# Altium schematic sheet Lipol_battery_charger.SchDoc
size A; SheetNumber: 1; SheetTotal: 1
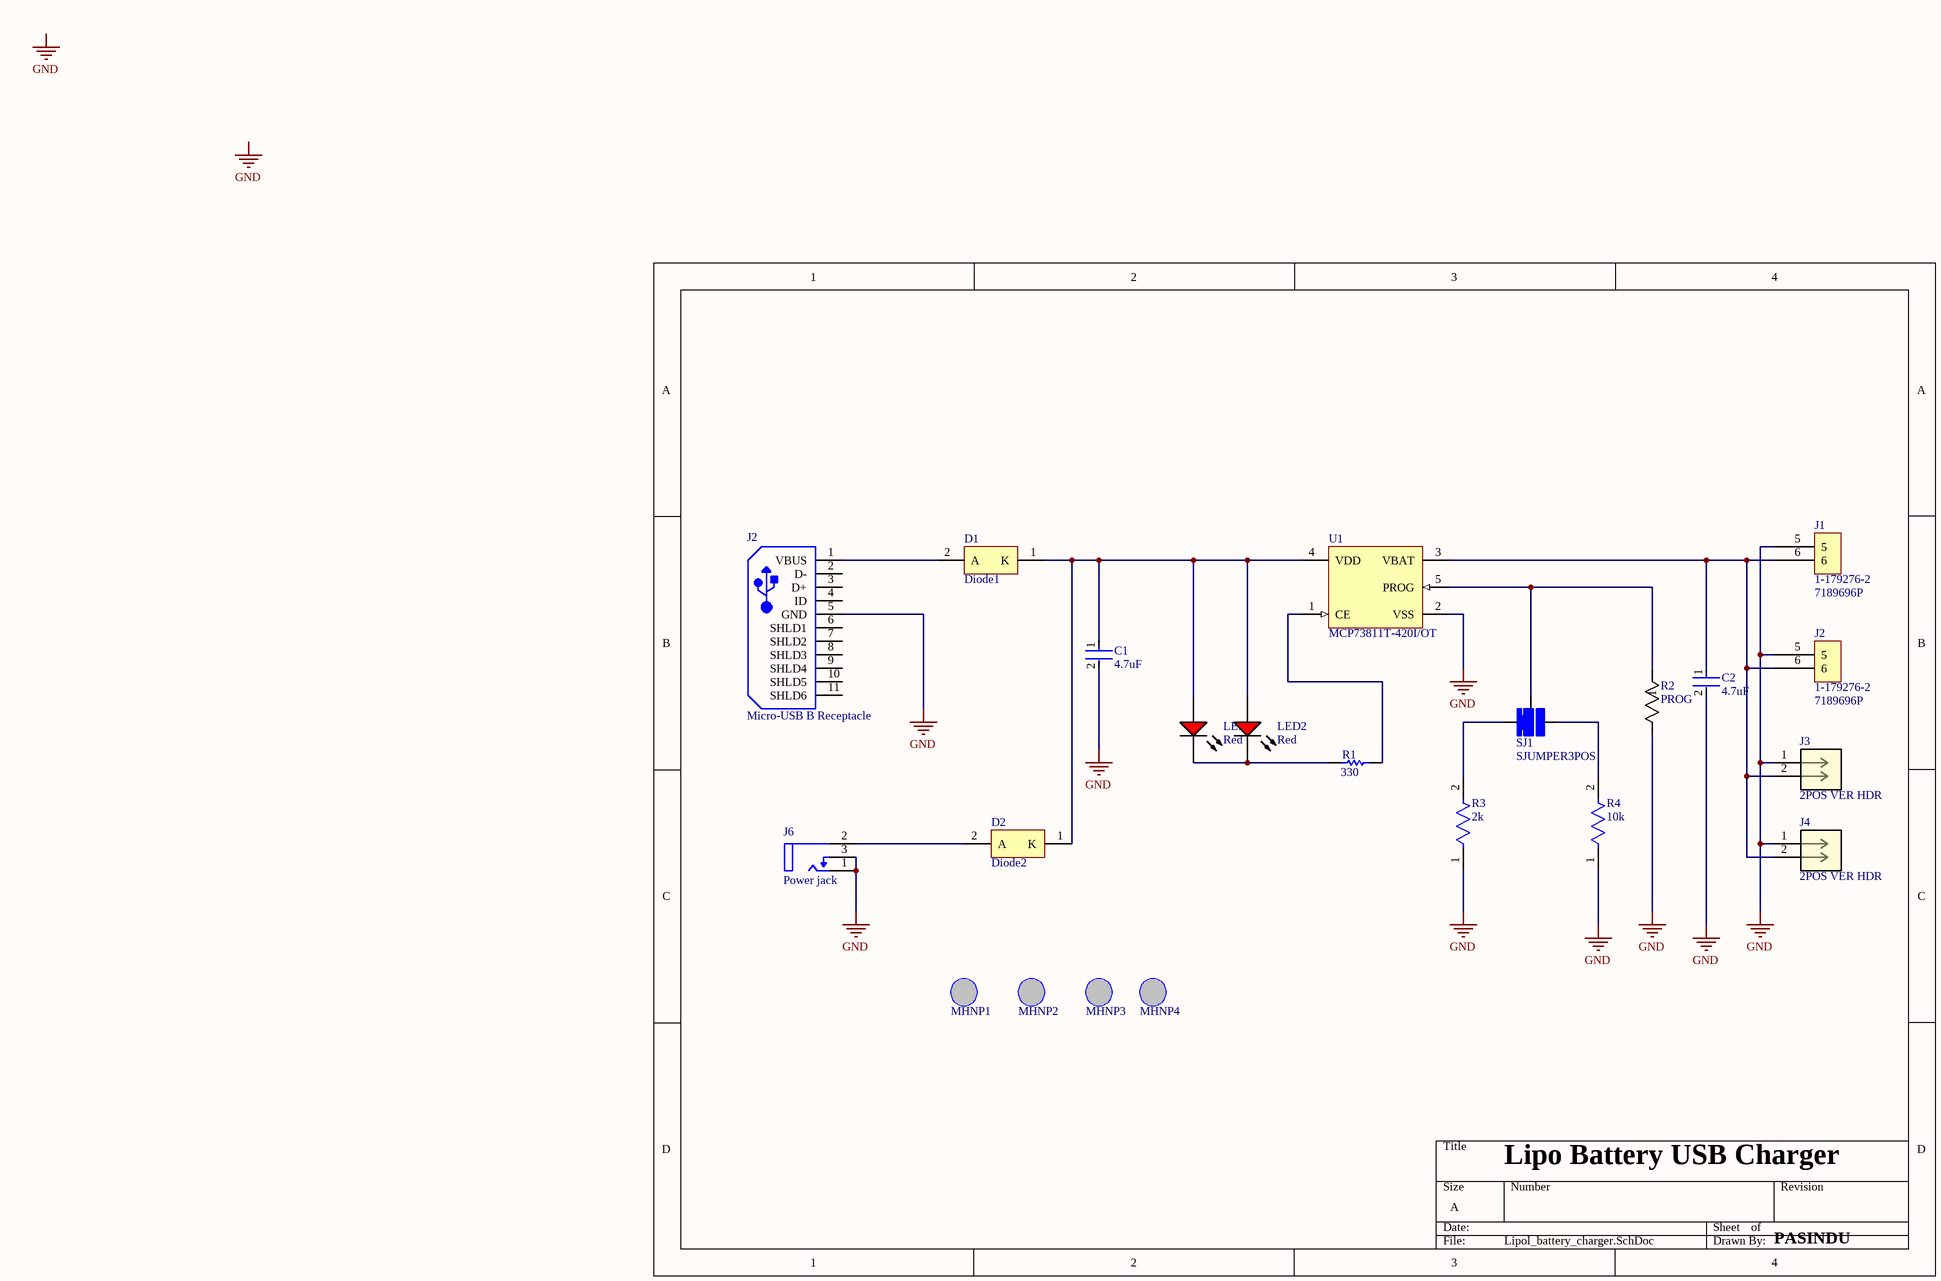
[diagram p0: Lipol_battery_charger.SchDoc]

## Parts
(Parts that share a designator on the sheet are numbered #1, #2 ... from top to bottom, then left to right.)
C1  4.7uF  [FP-CL10-IPC_C]
C2  4.7uF  [FP-CL10-IPC_C]
D1  Diode1  [ONSC-SMA-2-403D-02_V]
D2  Diode2  [ONSC-SMA-2-403D-02_V]
J1  1-179276-2  Supplier Part Number 1: 7189696P  [1-179276-2]
J2#1  Micro-USB B Receptacle  [USB-MICRO-B_V]
J2#2  1-179276-2  Supplier Part Number 1: 7189696P  [1-179276-2]
J3  2POS VER HDR  [CONN2_M20-999_1x2_HRW]
J4  2POS VER HDR  [CONN2_M20-999_1x2_HRW]
J6  Power jack  [FP-RASM722PTR13X-MFG]
LED1  Red  [VISH-TLMX1100_V]
LED2  Red  [VISH-TLMX1100_V]
MHNP1  Mounting hole non plated 3.2mm  [MHNP3P2MM]  (value not drawn)
MHNP2  Mounting hole non plated 3.2mm  [MHNP3P2MM]  (value not drawn)
MHNP3  Mounting hole non plated 3.2mm  [MHNP3P2MM]  (value not drawn)
MHNP4  Mounting hole non plated 3.2mm  [MHNP3P2MM]  (value not drawn)
R1  330  [RESC2013X70X40ML20T20]
R2  PROG  [RES_AC03_VIS]
R3  2k  [FP-CRCW0805-HPe3-IPC_C]
R4  10k  [FP-CRGCQ0805-IPC_C]
SJ1  SJUMPER3POS  [SJUMPER3POS-Footprint-1]
U1  MCP73811T-420I/OT  [SOT-23-OT5_L]

## Nets
GND: C1.2 C2.2 J1.5 J2#1.5(GND) J2#2.5 J3.1 J4.1 J6.1(TIP_TERMINAL(CENTER_PIN)) J6.3(SHUNT_TERMINAL) R2.2 R3.1 R4.1 U1.2(VSS)
NetC1_1: C1.1 D1.1(K) D2.1(K) LED1.1(A) LED2.1(A) U1.4(VDD)
NetC2_1: C2.1 J1.6 J2#2.6 J3.2 J4.2 U1.3(VBAT)
NetD1_2: D1.2(A) J2#1.1(VBUS)
NetD2_2: D2.2(A) J6.2(SLEEVE_TERMINAL)
NetLED1_2: LED1.2(K) LED2.2(K) R1.1
NetR1_2: R1.2 U1.1(CE)
NetR2_1: R2.1 SJ1.2 U1.5(PROG)
NetR3_2: R3.2 SJ1.1
NetR4_2: R4.2 SJ1.3

Not connected (* = marked no-connect by the designer): J2#1 2(D-) 3(D+) 4(ID) 6(SHLD1) 7(SHLD2) 8(SHLD3) 9(SHLD4) 10(SHLD5) 11(SHLD6)

## Notes on the sheet
- Lipo Battery USB Charger
- PASINDU
- Labels drawn without touching a wire or pin: GND

## Library data of the parts
C1 C2 = CMP-2000-06096-2: CAP CER 4.7UF 6.3V X7R 0603; Manufacturer: Samsung; Manufacturer Part Number: CL10B475KQ8NQNC; Tolerance: 10%; Material: Ceramic; Temperature Coefficient: 15%; Device Class L3: Ceramic Capacitors; Temperature Characteristic: X7R; Automotive: No; Capacitance: 4.7uF; Package: CL10; Device Class L2: Capacitors; Octopart: https://octopart.com/cl10b475kq8nqnc-samsung-24957976; ComponentLink2Description: Datasheet; Temperature Range High: +125°C; Lead Free: Yes; Height: 0.95mm; Temperature: -55°C to +125°C; Ipc Land Pattern Name: CAPC16080X80; Temperature Range Low: -55°C; Digikey Description: CAP CER 4.7UF 6.3V X7R 0603; Mouser Description: C Series 0402 4.7 uF 6.3 V ±20 % Tolerance X5R SMT Multilayer Ceramic Capacitor; Category: Cap; ComponentLink2URL: http://www.samsungsem.com/kr/support/product-search/mlcc/__icsFiles/afieldfile/2018/07/24/CL10B475KQ8NQNC.pdf; Value: 4.7uF; Voltage Rating: 6.3V; Device Class L1: Passive Components; RoHS: TRUE
D1 D2 = CMP-1055-00320-1: Schottky Power Rectifier, 2-Pin SMA, Pb-Free, Tape and Reel; PartNumber: MBRA140T3G; Manufacturer: On Semiconductor; Configuration: Single; IFSM Max (A): 30; PackageReference: SMA-2-403D-02; PackageDescription: 2-Pin Small Molded Package, J-Bend Lead, Body 2.605 x 4.315 mm; RoHS: TRUE; ComponentLink1Description: Manufacturer URL; Packing: Tape and Reel; ComponentLink3URL: http://www.onsemi.com/pub_link/Collateral/403D-02.PDF; ComponentLink2Description: Datasheet; ComponentLink2URL: http://www.onsemi.cn/pub_link/Collateral/MBRA140T3-D.PDF; DatasheetVersion: Rev. 10; ComponentLink1URL: http://www.onsemi.com/; ComponentLink3Description: Package Specification; Mounting Technology: Surface Mount; PackageVersion: Rev. G, 07/2012
J1 J2#2 = 1-179276-2: DYNAMIC 3200 HDR ASSY 2P H; Manufacture: TE connectivity; Supplier 1: Rs; Manufacture part Number: 1-179276-2; ComponentLink1Description: product URL; ComponentLink1URL: https://octopart.com/search?q=1-179276-2&filter%5Bfields%5D%5Bbrand.name%5D%5B%5D=TE+Connectivity
J2#1 = CMP-2000-05827-1: Micro-USB B Receptacle, Right Angle, Bottom Mount, Surface Mount, with Solder Tabs, -30 to 85 degC, 5-Pin USB, RoHS, Tape and Reel; Manufacturer: Molex; Featured Product: Micro-USBConnectorsUSBConnectors; Other Names: WM1399DKR; Package Version: Rev. F, 12/2012; Number of Contacts: 5; Connector Type: USB-microB; Catalog Drawings: 1050170001; 3D Model: 105017-0001.stp; Mating Products: WM17145-ND-CABLEMICROUSBBTOSTDA1.0MWM17147-ND-CABLEMICROUSBBTOSTDA2.0MWM17146-ND-CABLEMICROUSBBTOSTDA1.5M; PCN Assembly/Origin: ResinSupplier21/Oct/2015; Voltage - Max: 30V; Online Catalog: Molex-MicroUSB; Manufacturer URL: http://www.molex.com/; Package Description: 5-Leads USB, Micro B, Body 7.5 x 5 mm, Pitch 0.65 mm; Datasheet URL: http://www.molex.com/elqNow/elqRedir.htm?ref=http://www.molex.com/webdocs/datasheets/pdf/en-us/1050170001_IO_CONNECTORS.pdf; Ingress Protection: -; Datasheet Version: 03/2016; Mounting Type: BoardCutout,SurfaceMount,RightAngle; Circuits: 5; Standard Package: 1; Package Reference: MICRO-B; Package URL: http://www.molex.com/pdm_docs/sd/1050170001_sd.pdf; Category: Connectors,Interconnects; Series: -; RoHS Information: 1050170001CertofCompliance; Features: Shielded,SolderRetention; Family: USB,DVI,HDMIConnectors; Specifications: -; Gender: Receptacle; Packaging: Digi-Reel®; Mounting Technology: SurfaceMount
J3 J4 = M20-9990246: Connector Header Through Hole 2 position 0.100" (2.54mm); Mfr_Name: Harwin; RefDes: RefDes; Type: Type; ComponentLink1Description: New link; ComponentLink1URL: *; ComponentLink2Description: New link 1; ComponentLink2URL: https://www.digikey.com/en/products/detail/harwin-inc/M20-9990246/3728226
J6 = CMP-47995-000002-1: CONN PWR JACK 2.1X5.5MM SOLDER; Shielding: Unshielded; Gender: Male; Current Rating: 5A; Termination: Solder; Contact Material: Copper Alloy; Package Quantity: 120; Case/Package: SMD/SMT; Contact Plating: Tin; Connector Type: Jack; Housing Material: Thermoplastic; Mount: Surface Mount; Housing Color: Black; Color: Black
LED1 LED2 = CMP-1666-00027-1: LED, RED, 2.1 V, -40 to 100 degC, 2-Pin SMD (0603), RoHS, Tape and Reel; Type (Capacitors): C0G; Resistance: 100000000000 Ohm; Capacitance: 12 pF; Voltage Rating: 50 V; Tolerance: 5%; Min Operating Temperature: -55degC; REACH SVHC: No SVHC; ComponentLink2Description: Datasheet; ComponentLink1URL: http://www.vishay.com/; Width: 0.8 mm; Package Quantity: 4000; PackageReference: TLMX1100; ComponentLink2URL: http://www.vishay.com/docs/83173/tlmb1100.pdf; Case/Package: 0603; Case Code (Metric): 1608; Packaging: Tape and Reel; Pins: 2; ComponentLink1Description: Manufacturer URL; Max Operating Temperature: 125degC; Height: 0.8 mm; Length: 1.6 mm; Mount: Surface Mount; PackageDescription: 2-Pin Surface Mount Device, Body 1.6 x 0.8 mm; DatasheetVersion: Rev. 2.7, 03/2016; Case Code (Imperial): 0603; Voltage Rating (DC): 50 V; RoHSCompliant: True; Radiation Hardening: No
MHNP1-MHNP4 = MTHNP3P2MM: Mounting hole non plated 3.2mm drill hole
R1 = CMP-2001-00533-1: Manufacturer: Panasonic; Part Number: ERJ6ENF3301V
R2 = CMP-00030-39745976-1: AC03000001009JAC00 VISHAY AC03000001009JAC00 Through Hole Resistor, 10 ohm, Axial Leaded, 3 W, 5%, AC Series; Resistance: 10Ω; Lead Diameter: 800µm; Max Power Dissipation: 3W; Temperature Coefficient: -80ppm/°C; Voltage Rating (DC): 5V; Number of Pins: 2; REACH SVHC: Unknown; Width: 4.8006mm; Contact Plating: Tin; Schedule B: 8533210080, 8533210080; Military Standard: Not; Case/Package: Conformal; Voltage Rating: 5V; Diameter: 4.8mm; Number of Terminations: 2; Termination: Axial; Mount: Through Hole; NexarPartId: 39745976; Composition: Wirewound; Max Operating Temperature: 275°C; Packaging: Cut Tape (CT); Tolerance: 5%; Power Rating: 3W; Min Operating Temperature: 0°C; RoHS: Compliant; Features: Flame Retardant Coating; Length: 13mm; Radiation Hardening: No
R3 = CMP-2001-04188-2: RES Thick Film, 2kΩ, 1%, 0.5W, 100ppm/°C, 0805; Resistance: 2kR; Power Rating: 330mW; Voltage Rating: 150V; Length: 2mm; Width: 1.2mm; Tolerance: 1%; Termination: SMD/SMT; Radiation Hardening: No; Height: 0.5mm; Packaging: Tape and Reel; Depth: 1.25mm; Case Code (Imperial): 0805; Mount: Surface Mount; Min Operating Temperature: -55°C; Case/Package: 0805; Contact Plating: Tin; Lead Free: Lead Free; Case Code (Metric): 2012; Temperature Coefficient: 100ppm/°C; Composition: Thick Film; Military Standard: Not; Max Operating Temperature: 155°C; Weight: 0.000194oz; Package Quantity: 5000
R4 = CMP-03211-002989-1: CRGCQ 0805 10K 5%; Manufacturer Part Number: CRGCQ0805J10K; Manufacturer: TE Connectivity; Voltage Rating: 150V; Temperature Coefficient: ±100ppm/°C; Resistance: 10KΩ; Value: 10KΩ; Power Rating: 0.125W; Tolerance: 0.05; Automotive Grade: Grade 914; Height: 0.65mm; Lead Free: Yes; Temperature Range High: +155°C; Composition: Thick Film; Temperature Range Low: -55°C; Ambient Temperature Range High: +70°C; Temperature: -55°C to +155°C; Package: CRGCQ0805; Device Class L2: Resistors; RoHS: TRUE; ComponentLink2URL: https://www.te.com/commerce/DocumentDelivery/DDEController?Action=showdoc&DocId=Data+Sheet%7F1773204-3%7F1%7Fpdf%7FEnglish%7FENG_DS_1773204-3_1.pdf%7F4-2176341-923; Series: CRGCQ; Device Class L1: Passive Components; Ipc Land Pattern Name: RESC200125X55; ComponentLink2Description: Datasheet; Category: Res; Digikey Description: CRGCQ 0805 10K 5%; Mouser Description: Res Thick Film 0805 10K Ohm 5% 0.125W(1/8W) ±100ppm/C Pad SMD Automotive T/R; Automotive: Yes; Octopart: https://octopart.com/crgcq0805j10k-te+connectivity-91018201; Device Class L3: Chip SMD Resistors
SJ1 = CMP-001-0000-1: Solder jumper 3 pads and pin; pin: 3
U1 = CMP-0133-00139-1: Simple, Miniature Single-Cell, Fully Integrated Li-Ion/Li-Polymer Charge Management Controller, 4.2V, 5-Pin SOT-23, Industrial Temperature, Tape and Reel; Code_IPC: SOT23-5; PackageDescription: 5-Lead Plastic Small Outline Transistor (OT) [SOT-23]; PackageVersion: revBB, Aug-2009; DatasheetVersion: revB, Sep-2007; PackageReference: SOT-23-OT5